# Altium schematic sheet Schematic.SchDoc
size A4
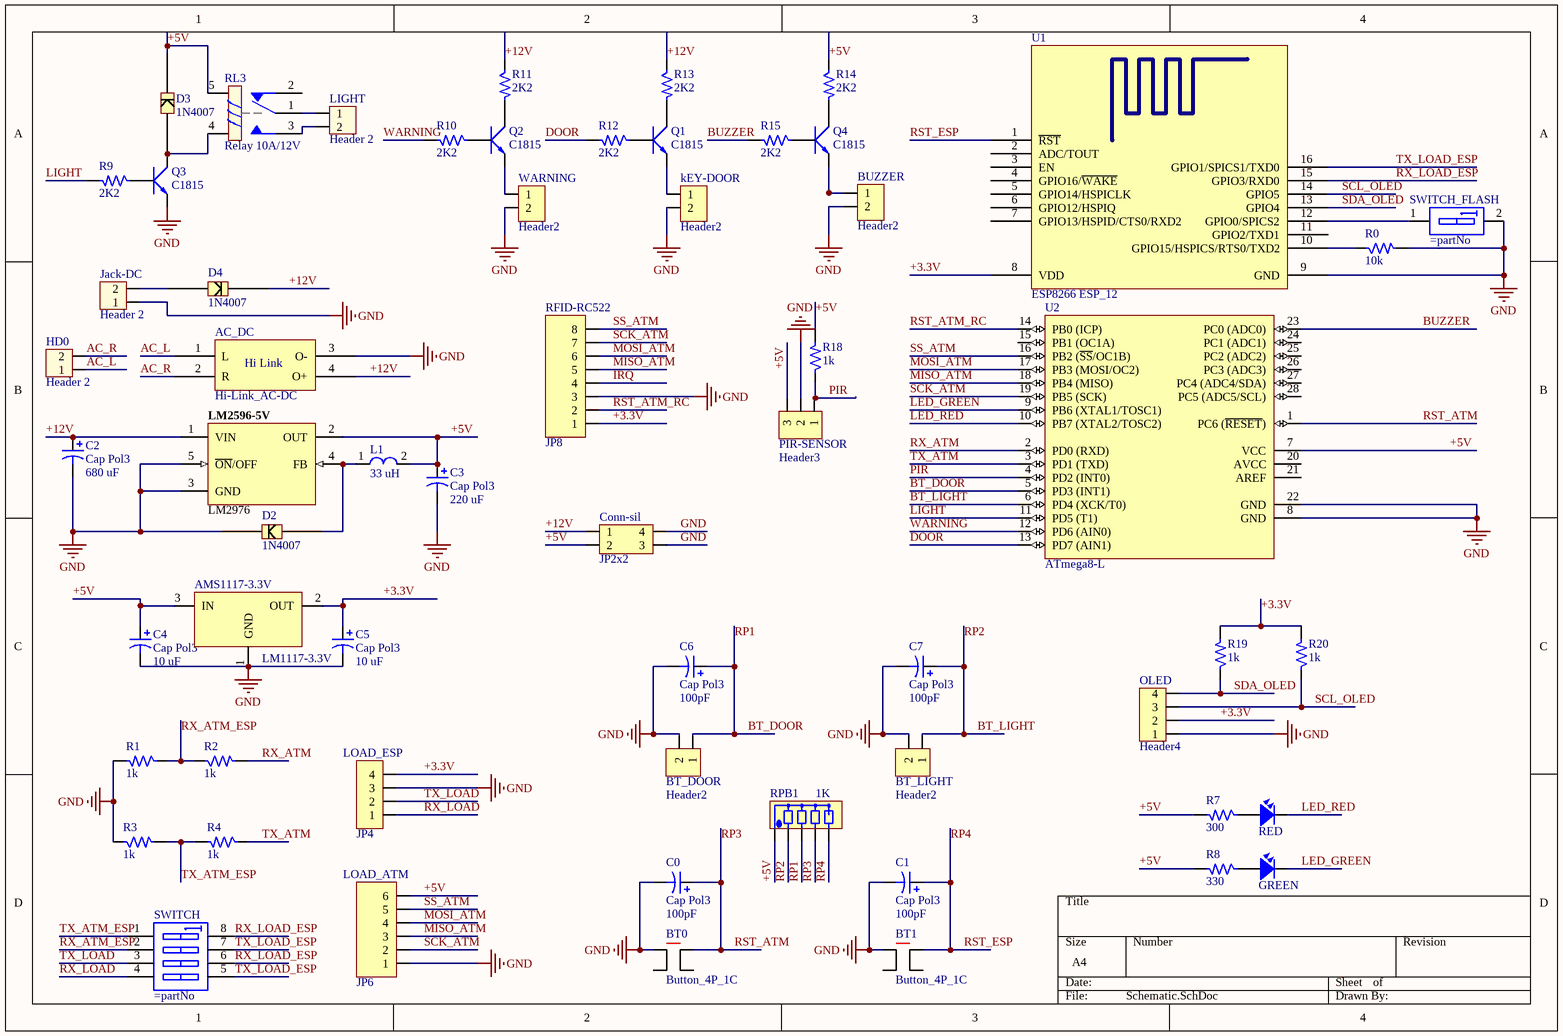
[diagram p0: Schematic.SchDoc]

## Parts
AC_DC  Hi-Link_AC-DC  [Hi-Link AC-DC]
AMS1117-3.3V  LM1117-3.3V  [SOT223]
BT0  Button_4P_1C  [Button_SMD_4P_1C]
BT1  Button_4P_1C  [Button_SMD_4P_1C]
BT_DOOR  Header2  [Header2]
BT_LIGHT  Header2  [Header2]
BUZZER  Header2  [Header2]
C0  Cap Pol3  value 100pF  [1812]
C1  Cap Pol3  value 100pF  [1812]
C2  Cap Pol3  value 680 uF  [1812]
C3  Cap Pol3  value 220 uF  [1812]
C4  Cap Pol3  value 10 uF  [1812]
C5  Cap Pol3  value 10 uF  [1812]
C6  Cap Pol3  value 100pF  [1812]
C7  Cap Pol3  value 100pF  [1812]
Conn-sil  JP2x2  [JP2-C2T]
D2  1N4007  [1N4007-SMD]
D3  1N4007  [1N4007-SMD]
D4  1N4007  [1N4007-SMD]
GREEN  LED  [LED-0805-Green]  (value not drawn)
HD0  Header 2  [HED2]
Jack-DC  Header 2  [HED2]
kEY-DOOR  Header2  [Header2]
L1  33 uH  [L-SMD-M-12x10]
LIGHT  Header 2  [HED2]
LM2596-5V  LM2976  [TO263]
LOAD_ATM  JP6  [JP6-C1T]
LOAD_ESP  JP4  [JP4-C1T]
OLED  Header4  [Header4]
PIR-SENSOR  Header3  [Header3]
Q1  C1815  [SOT23B]
Q2  C1815  [SOT23B]
Q3  C1815  [SOT23B]
Q4  C1815  [SOT23B]
R0  10k  [SM-RES-1206]
R1  1k  [SM-RES-1206]
R2  1k  [SM-RES-1206]
R3  1k  [SM-RES-1206]
R4  1k  [SM-RES-1206]
R7  300  [SM-RES-1206]
R8  330  [SM-RES-1206]
R9  2K2  [SM-RES-1206]
R10  2K2  [SM-RES-1206]
R11  2K2  [SM-RES-1206]
R12  2K2  [SM-RES-1206]
R13  2K2  [SM-RES-1206]
R14  2K2  [SM-RES-1206]
R15  2K2  [SM-RES-1206]
R18  1k  [SM-RES-1206]
R19  1k  [SM-RES-1206]
R20  1k  [SM-RES-1206]
RED  LED  [LED-0805-Red]  (value not drawn)
RFID-RC522  JP8  [JP8-D1T]
RL3  Relay 10A/12V  [RL_SPDT_10A]
RPB1  1K  [RN4]
SWITCH  (no value)  [SW-DIP4]
SWITCH_FLASH  (no value)  [SW-DIP1-1]
U1  ESP8266 ESP_12  [ESP8266 ESP_12]
U2  ATmega8-L  [QFP7X7-G32/X.45N]
WARNING  Header2  [Header2]

## Nets
GND: AC_DC.3(O-) AMS1117-3.3V.1(GND) BT0.4 BT1.4 BT_DOOR.2 BT_LIGHT.2 BUZZER.2 C0.2 C1.2 C2.2 C3.2 C4.2 C5.2 C6.2 C7.2 Conn-sil.3 Conn-sil.4 D2.1(K-) Jack-DC.1 kEY-DOOR.2 LM2596-5V.3(GND) LM2596-5V.5(~{ON}/OFF) LOAD_ATM.1 LOAD_ESP.3 OLED.1 PIR-SENSOR.2 Q3.1(E) R0.2 R1.2 R3.1 RFID-RC522.3 SWITCH_FLASH.2 U1.9(GND) U2.8(GND) U2.22(GND) WARNING.2
+3.3V: AMS1117-3.3V.2(OUT) C5.1 LOAD_ESP.4 OLED.2 R19.2 R20.2 RFID-RC522.1 U1.8(VDD)
+5V: AMS1117-3.3V.3(IN) C3.1 C4.1 Conn-sil.2 D3.1(K-) L1.2 LM2596-5V.2(OUT) LOAD_ATM.6 PIR-SENSOR.3 R7.2 R8.2 R14.1 R18.2 RL3.5 RPB1.1 U2.7(VCC)
+12V: AC_DC.4(O+) C2.1 Conn-sil.1 D4.1(K-) LM2596-5V.1(VIN) R11.1 R13.1
AC_L: AC_DC.1(L) HD0.1
AC_R: AC_DC.2(R) HD0.2
BT_DOOR: BT_DOOR.1 C6.1 RPB1.3 U2.5(PD3_(INT1))  [also labelled RP1]
BT_LIGHT: BT_LIGHT.1 C7.1 RPB1.2 U2.6(PD4_(XCK/T0))  [also labelled RP2]
BUZZER: R15.2 U2.23(PC0_(ADC0))
DOOR: R12.2 U2.13(PD7_(AIN1))
IRQ: RFID-RC522.4
LED_GREEN: GREEN.2 U2.9(PB6_(XTAL1/TOSC1))
LED_RED: RED.2 U2.10(PB7_(XTAL2/TOSC2))
LIGHT: R9.2 U2.11(PD5_(T1))
MISO_ATM: LOAD_ATM.3 RFID-RC522.5 U2.18(PB4_(MISO))
MOSI_ATM: LOAD_ATM.4 RFID-RC522.6 U2.17(PB3_(MOSI/OC2))
PIR: PIR-SENSOR.1 R18.1 U2.4(PD2_(INT0))
RP3: BT0.3 C0.1 RPB1.4 U2.1(PC6_(~{RESET}))  [also labelled RST_ATM]
RP4: BT1.3 C1.1 RPB1.5 U1.1(~{RST})  [also labelled RST_ESP]
RST_ATM_RC: RFID-RC522.2 U2.14(PB0_(ICP))
RX_ATM: R2.2 U2.2(PD0_(RXD))
RX_ATM_ESP: R1.1 R2.1 SWITCH.2
RX_LOAD: LOAD_ESP.1 SWITCH.4
RX_LOAD_ESP: SWITCH.6 SWITCH.8 U1.15(GPIO3/RXD0)
SCK_ATM: LOAD_ATM.2 RFID-RC522.7 U2.19(PB5_(SCK))
SCL_OLED: OLED.3 R20.1 U1.14(GPIO5)
SDA_OLED: OLED.4 R19.1 U1.13(GPIO4)
SS_ATM: LOAD_ATM.5 RFID-RC522.8 U2.16(PB2_(~{SS}/OC1B))
TX_ATM: R4.1 U2.3(PD1_(TXD))
TX_ATM_ESP: R3.2 R4.2 SWITCH.1
TX_LOAD: LOAD_ESP.2 SWITCH.3
TX_LOAD_ESP: SWITCH.5 SWITCH.7 U1.16(GPIO1/SPICS1/TXD0)
WARNING: R10.2 U2.12(PD6_(AIN0))
NetBUZZER_1: BUZZER.1 Q4.1(E)
NetD2_2: D2.2(A+) L1.1 LM2596-5V.4(FB)
NetD3_2: D3.2(A+) Q3.2(C) RL3.4
NetD4_2: D4.2(A+) Jack-DC.2
NetGREEN_1: GREEN.1 R8.1
NetkEY-DOOR_1: kEY-DOOR.1 Q1.1(E)
NetLIGHT_1: LIGHT.1 RL3.1
NetLIGHT_2: LIGHT.2 RL3.3
NetQ1_2: Q1.2(C) R13.2
NetQ1_3: Q1.3(B) R12.1
NetQ2_1: Q2.1(E) WARNING.1
NetQ2_2: Q2.2(C) R11.2
NetQ2_3: Q2.3(B) R10.1
NetQ3_3: Q3.3(B) R9.1
NetQ4_2: Q4.2(C) R14.2
NetQ4_3: Q4.3(B) R15.1
NetR0_1: R0.1 U1.10(GPIO15/HSPICS/RTS0/TXD2)
NetR7_1: R7.1 RED.1
NetSWITCH_FLASH_1: SWITCH_FLASH.1 U1.12(GPIO0/SPICS2)

Not connected (* = marked no-connect by the designer): BT0 1 2; BT1 1 2; RL3 2; U1 2(ADC/TOUT) 3(EN) 4(GPIO16/~{WAKE}) 5(GPIO14/HSPICLK) 6(GPIO12/HSPIQ) 7(GPIO13/HSPID/CTS0/RXD2) 11(GPIO2/TXD1); U2 15(PB1_(OC1A)) 20(AVCC) 21(AREF) 24(PC1_(ADC1)) 25(PC2_(ADC2)) 26(PC3_(ADC3)) 27(PC4_(ADC4/SDA)) 28(PC5_(ADC5/SCL))

## Notes on the sheet
- (in symbol Hi-Link_AC-DC) Hi Link

## Library data of the parts
AC_DC = Hi-Link_AC-DC: Hi Link AC-DC convert
AMS1117-3.3V = LM1117: 800mA Low-Dropout Linear Regulator; Creator: Nguyen Ba Bien; Website: http://group3i.net
BT0 BT1 = Button_4P_1C: Button 4 pins 1 channel
BT_DOOR BT_LIGHT BUZZER kEY-DOOR WARNING = Header2: Header IDC, 2 x 1 Pin Vertical 2.54mm Pitch (Non-Boxed, Male); Manufacturer: W¨¹rth Elektronik eiSos GmbH; partNo: 613002143121; ComponentLink1 Description: Manufacturer; ComponentLink2 Description: Datasheet; NoPins: 02; Created Date: 29 March 2013; ComponentLink1URL: http://www.we-online.com; ComponentLink2URL: http://katalog.we-online.de/em/datasheet/6130xx143121.pdf; Created by: Karrer Zheng
C0-C7 = Cap Pol3: Polarized Capacitor (Surface Mount); Published: 8-Jun-2000; LatestRevisionDate: 29-May-2009; LatestRevisionNote: IPC-7351 Footprint Added.; PackageReference: C0805; Publisher: Altium Limited; PackageDescription: Chip Capacitor
Conn-sil = JP2x2: WR-PHD 2.54 mm Dual Socket Header; Manufacturer: W¨¹rth Elektronik eiSos GmbH; partNo: 61300421821; ComponentLink1 Description: Manufacturer; ComponentLink2 Description: Datasheet; NoPins: 04; Created Date: 29 March 2013; ComponentLink1URL: http://www.we-online.com; ComponentLink2URL: http://katalog.we-online.de/em/datasheet/6130xx21821.pdf; Created by: Karrer Zheng
D2-D4 = 1N4007: Diode 1N4007; Value: Jac DC
GREEN RED = LED SMD: Value: LED 3 - 5 ly 2 Colour
HD0 Jack-DC LIGHT = Hed2: Header 2 (Green); Value: Header 2
L1 = L-SMD-1: partNo: 78477010; Manufacturer: Wurth Elektronik; Inductance: 1.0 μH; ComponentLink1Description: Manufacturer; ComponentLink1URL: http://www.we-online.de; Created by: Baojun Chen; Created Date: Nov.2015; ComponentLink2Description: Datasheet; ComponentLink2URL: http://katalog.we-online.de/pbs/datasheet/78477010.pdf
LM2596-5V = LM2596: Max Input Voltage: 12 V; Max Output Current: 3 (6.0 peak) A; Max Output Voltage: mV; Category: IC-Power; Min Input Voltage: mV; Min Output Voltage: mV; Mounting Technology: Surface Mount; Status: Unreleased; Supply Voltage: mV; Temperature Range: -40 to +125 degC
LOAD_ATM = JP6: WR-PHD 2.54 mm Angled Socket Header; Manufacturer: W¨¹rth Elektronik eiSos GmbH; partNo: 613006143121; ComponentLink1 Description: Manufacturer; ComponentLink2 Description: Datasheet; NoPins: 06; Created Date: 29 March 2013; ComponentLink1URL: http://www.we-online.com; ComponentLink2URL: http://katalog.we-online.de/em/datasheet/6130xx143121.pdf; Created by: Karrer Zheng
LOAD_ESP = JP4: WR-PHD 2.54 mm Angled Socket Header; Manufacturer: W¨¹rth Elektronik eiSos GmbH; partNo: 613004143121; ComponentLink1 Description: Manufacturer; ComponentLink2 Description: Datasheet; NoPins: 04; Created Date: 29 March 2013; ComponentLink1URL: http://www.we-online.com; ComponentLink2URL: http://katalog.we-online.de/em/datasheet/6130xx143121.pdf; Created by: Karrer Zheng
OLED = Header4: Header IDC, 4 x 1 Pin Vertical 2.54mm Pitch (Non-Boxed, Male); Manufacturer: W¨¹rth Elektronik eiSos GmbH; partNo: 613002143121; ComponentLink1 Description: Manufacturer; ComponentLink2 Description: Datasheet; NoPins: 02; Created Date: 29 March 2013; ComponentLink1URL: http://www.we-online.com; ComponentLink2URL: http://katalog.we-online.de/em/datasheet/6130xx143121.pdf; Created by: Karrer Zheng
PIR-SENSOR = Header3: Header IDC, 3 x 1 Pin Vertical 2.54mm Pitch (Non-Boxed, Male); Manufacturer: W¨¹rth Elektronik eiSos GmbH; partNo: 613002143121; ComponentLink1 Description: Manufacturer; ComponentLink2 Description: Datasheet; NoPins: 02; Created Date: 29 March 2013; ComponentLink1URL: http://www.we-online.com; ComponentLink2URL: http://katalog.we-online.de/em/datasheet/6130xx143121.pdf; Created by: Karrer Zheng
Q1-Q4 = C1815: NPN 600mW, ECB; Value: C1815
R0-R4 R7-R15 R18-R20 = R: Resistor 1/4W; Value: R1/4W - 1K
RFID-RC522 = JP8: WR-PHD 2.54 mm Angled Socket Header; Manufacturer: W¨¹rth Elektronik eiSos GmbH; partNo: 613008143121; ComponentLink1 Description: Manufacturer; ComponentLink2 Description: Datasheet; NoPins: 08; Created Date: 29 March 2013; ComponentLink1URL: http://www.we-online.com; ComponentLink2URL: http://katalog.we-online.de/em/datasheet/6130xx143121.pdf; Created by: Karrer Zheng
RL3 = Relay 1: Relay SPDT,10A - 12VDC 5 Pin; Value: Relay SPDT, 10A, 12V
RPB1 = RN4: Resistor 4(Thanh); Value: Tro thanh 10K
SWITCH = SWDIP4: WS-DITV 2.54 mm small compact THT flat actuator with top tape; Manufacturer: Wurth Elektronik; Part No.: 418127160904; ComponentLink1 Description: Manufacturer; ComponentLink2 Description: Datasheet; Pole: 04; Created Date: Dec.2015; ComponentLink1URL: http://www.we-online.com; ComponentLink2URL: http://katalog.we-online.de/em/datasheet/4181271609xx.pdf; Created by: Baojun Chen
SWITCH_FLASH = SWDIP1: WS-DITV 2.54 mm small compact THT flat actuator with top tape; Manufacturer: Wurth Elektronik; Part No.: 418127160901; ComponentLink1 Description: Manufacturer; ComponentLink2 Description: Datasheet; Pole: 01; Created Date: Dec.2015; ComponentLink1URL: http://www.we-online.com; ComponentLink2URL: http://katalog.we-online.de/em/datasheet/4181271609xx.pdf; Created by: Baojun Chen
U1 = ESP8266 ESP_12: ESP8266 ESP-12; IC: ESP8266-EX; Vendor: Ai-thinker; LatestReviewer: Zion Blue; Published: 14-Apr-2015; Publisher: Cynetik Group; LatestRevisionData: 14-Apr-2015; LatestRevisionNote: Include 3D body and Footprint
U2 = ATmega8-L: 8-Bit AVR Microcontroller with 8K Bytes of In-System Programmable Flash Memory; Value: ATmega8-L